# Altium schematic sheet 01_Table_Of_Contents.SchDoc
size B
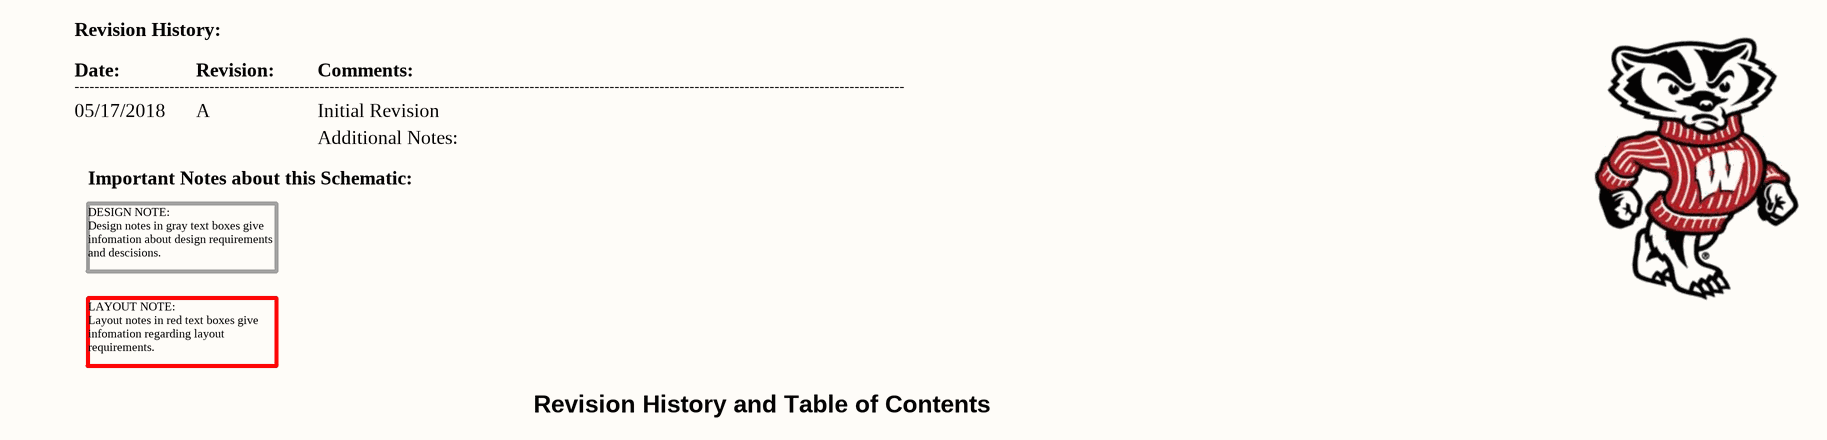
[diagram p0: 01_Table_Of_Contents.SchDoc]

## Notes on the sheet
- Revision History:
- Date:
- 05/17/2018
- ----------------------------------------------------------------------------------------------------------------------------------------------------------------------
- Revision:
- A
- Comments:
- Initial Revision
- Important Notes about this Schematic:
- Additional Notes:
- DESIGN NOTE:
  Design notes in gray text boxes give infomation about design requirements and descisions.
- LAYOUT NOTE:
  Layout notes in red text boxes give infomation regarding layout requirements.
- Revision History and Table of Contents